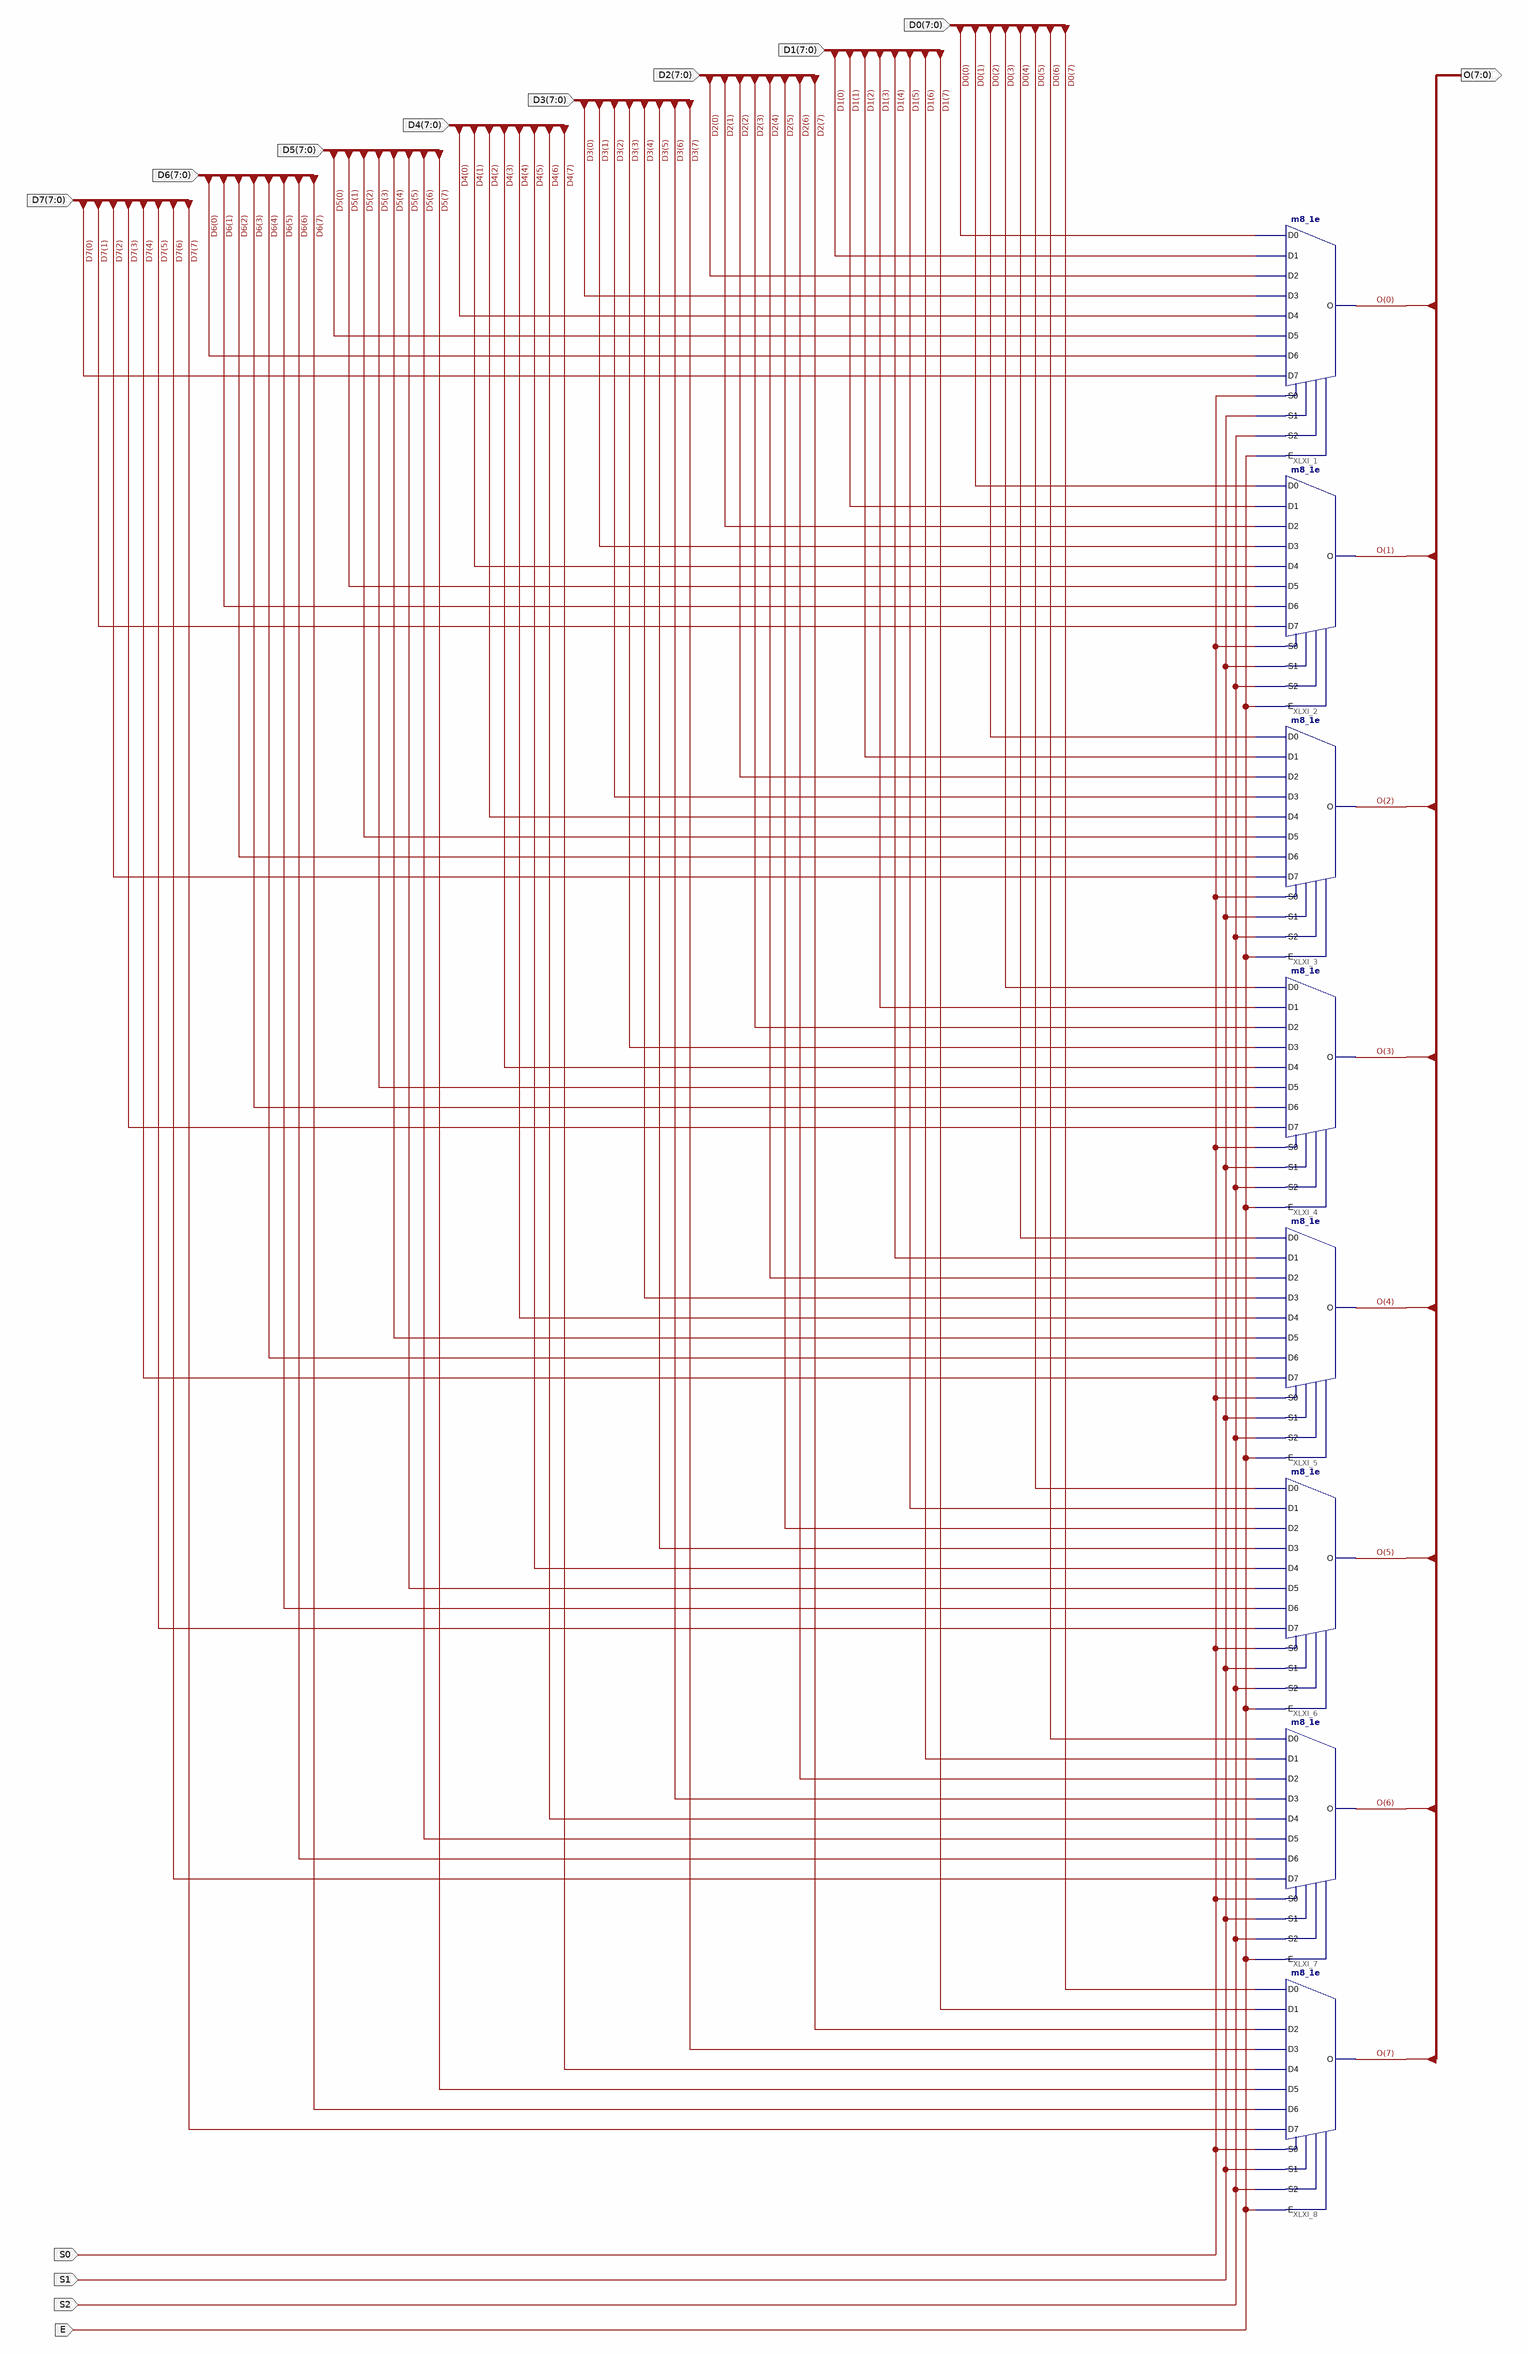
[diagram p0: schematic sheet 1]
// Xilinx ISE schematic mux8x1x8e.sch (spartan6) as structural Verilog: 8 symbols, 13 ports
module mux8x1x8e (
  input  [7:0] D7,
  input  [7:0] D6,
  input  [7:0] D5,
  input  [7:0] D4,
  input  [7:0] D3,
  input  [7:0] D2,
  input  [7:0] D1,
  input  [7:0] D0,
  input  E,
  input  S2,
  input  S1,
  input  S0,
  output [7:0] O
);

  m8_1e XLXI_1 (
    .D0(D0[0]), .D1(D1[0]), .D2(D2[0]), .D3(D3[0]), .D4(D4[0]), .D5(D5[0]), .D6(D6[0]), .D7(D7[0]), .E(E),
    .S0(S0), .S1(S1), .S2(S2), .O(O[0]));
  m8_1e XLXI_2 (
    .D0(D0[1]), .D1(D1[1]), .D2(D2[1]), .D3(D3[1]), .D4(D4[1]), .D5(D5[1]), .D6(D6[1]), .D7(D7[1]), .E(E),
    .S0(S0), .S1(S1), .S2(S2), .O(O[1]));
  m8_1e XLXI_3 (
    .D0(D0[2]), .D1(D1[2]), .D2(D2[2]), .D3(D3[2]), .D4(D4[2]), .D5(D5[2]), .D6(D6[2]), .D7(D7[2]), .E(E),
    .S0(S0), .S1(S1), .S2(S2), .O(O[2]));
  m8_1e XLXI_4 (
    .D0(D0[3]), .D1(D1[3]), .D2(D2[3]), .D3(D3[3]), .D4(D4[3]), .D5(D5[3]), .D6(D6[3]), .D7(D7[3]), .E(E),
    .S0(S0), .S1(S1), .S2(S2), .O(O[3]));
  m8_1e XLXI_5 (
    .D0(D0[4]), .D1(D1[4]), .D2(D2[4]), .D3(D3[4]), .D4(D4[4]), .D5(D5[4]), .D6(D6[4]), .D7(D7[4]), .E(E),
    .S0(S0), .S1(S1), .S2(S2), .O(O[4]));
  m8_1e XLXI_6 (
    .D0(D0[5]), .D1(D1[5]), .D2(D2[5]), .D3(D3[5]), .D4(D4[5]), .D5(D5[5]), .D6(D6[5]), .D7(D7[5]), .E(E),
    .S0(S0), .S1(S1), .S2(S2), .O(O[5]));
  m8_1e XLXI_7 (
    .D0(D0[6]), .D1(D1[6]), .D2(D2[6]), .D3(D3[6]), .D4(D4[6]), .D5(D5[6]), .D6(D6[6]), .D7(D7[6]), .E(E),
    .S0(S0), .S1(S1), .S2(S2), .O(O[6]));
  m8_1e XLXI_8 (
    .D0(D0[7]), .D1(D1[7]), .D2(D2[7]), .D3(D3[7]), .D4(D4[7]), .D5(D5[7]), .D6(D6[7]), .D7(D7[7]), .E(E),
    .S0(S0), .S1(S1), .S2(S2), .O(O[7]));
endmodule
